# Altium project bms_mainboard-1_1.PrjPcb (part 3 of 8)

## Sheet pmic_tps65263_buck.SchDoc
size B
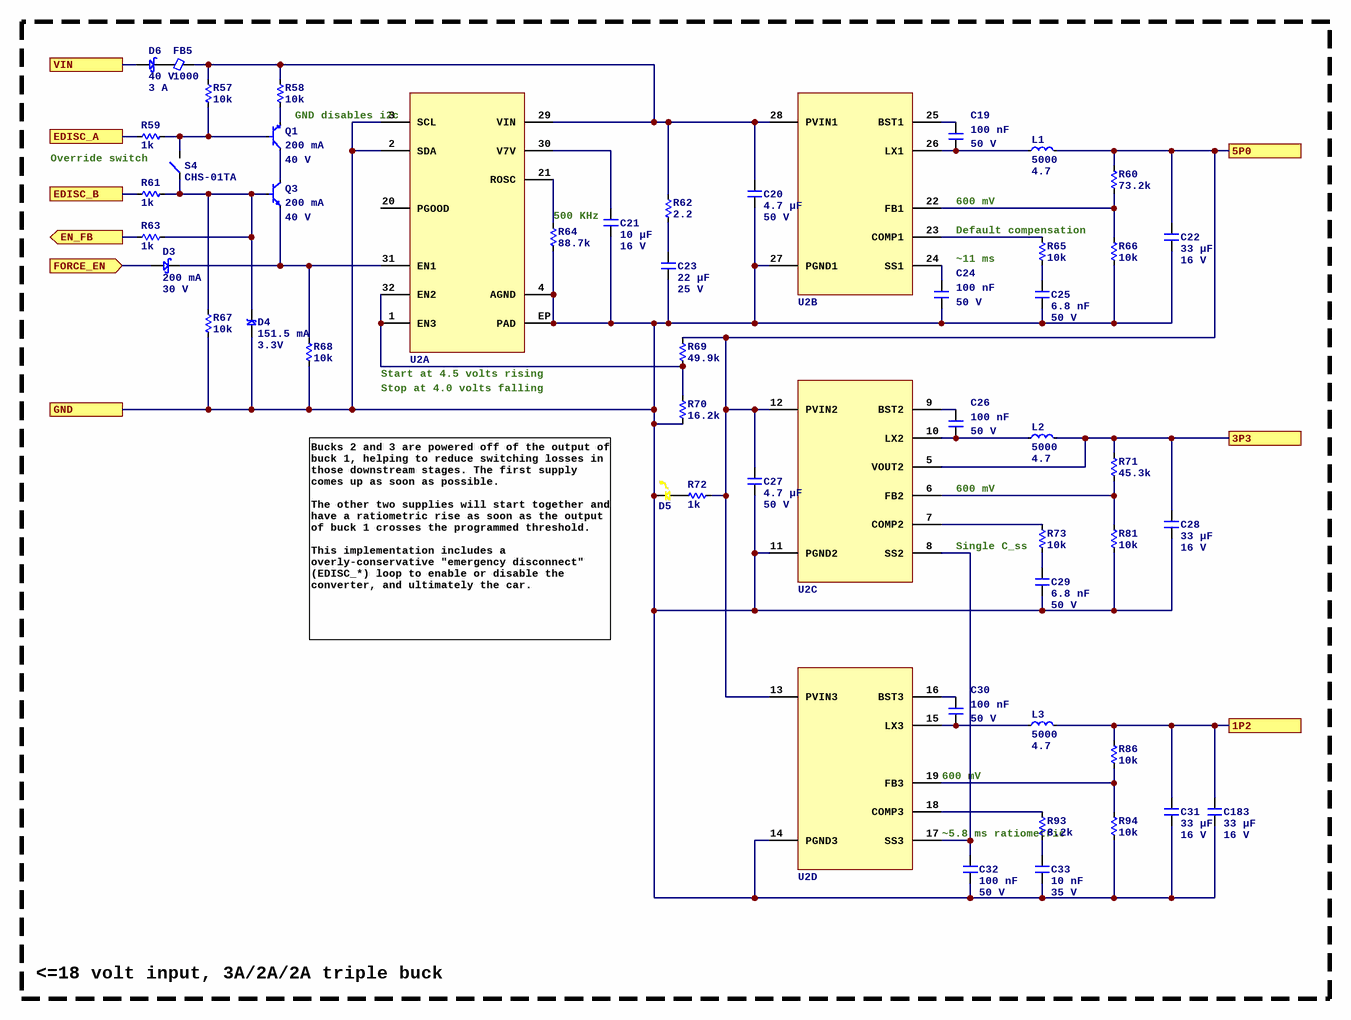
[diagram p13: pmic_tps65263_buck.SchDoc]

### Parts
C19  Capacitance: 100 nF  Voltage Rating: 50 V  [C0402]  (hidden comment: CL05B104KB54PNC)
C20  Capacitance: 4.7 µF  Voltage Rating: 50 V  [C0805]  (hidden comment: 0805B475K500NT)
C21  Capacitance: 10 µF  Voltage Rating: 16 V  [C0805]  (hidden comment: CL21B106KOQNNNE)
C22  Capacitance: 33 µF  Voltage Rating: 16 V  [C1812]  (hidden comment: C4532X7R1C336MT000N)
C23  Capacitance: 22 µF  Voltage Rating: 25 V  [C2220]  (hidden comment: C5750X7R1E226MT000N)
C24  Capacitance: 100 nF  Voltage Rating: 50 V  [C0402]  (hidden comment: CL05B104KB54PNC)
C25  Capacitance: 6.8 nF  Voltage Rating: 50 V  [C0402]  (hidden comment: GRM1555C1H682GE01D)
C26  Capacitance: 100 nF  Voltage Rating: 50 V  [C0402]  (hidden comment: CL05B104KB54PNC)
C27  Capacitance: 4.7 µF  Voltage Rating: 50 V  [C0805]  (hidden comment: 0805B475K500NT)
C28  Capacitance: 33 µF  Voltage Rating: 16 V  [C1812]  (hidden comment: C4532X7R1C336MT000N)
C29  Capacitance: 6.8 nF  Voltage Rating: 50 V  [C0402]  (hidden comment: GRM1555C1H682GE01D)
C30  Capacitance: 100 nF  Voltage Rating: 50 V  [C0402]  (hidden comment: CL05B104KB54PNC)
C31  Capacitance: 33 µF  Voltage Rating: 16 V  [C1812]  (hidden comment: C4532X7R1C336MT000N)
C32  Capacitance: 100 nF  Voltage Rating: 50 V  [C0402]  (hidden comment: CL05B104KB54PNC)
C33  Capacitance: 10 nF  Voltage Rating: 35 V  [C0402]  (hidden comment: GRM1555CYA103GE01D)
C183  Capacitance: 33 µF  Voltage Rating: 16 V  [C1812]  (hidden comment: C4532X7R1C336MT000N)
D3  Current: 200 mA  Vr: 30 V  [SOD523]  (hidden comment: BAT54XV2T1G)
D4  Current: 151.5 mA  Vr: 3.3V  [SOD523]  (hidden comment: SZMM5Z3V3T1G)
D5  LTST-C190YKT  [LED_0603P_YELLOW]  (value not drawn)
D6  Vr: 40 V  Current: 3 A  [SMA]  (hidden comment: B340A-13-F)
FB5  Current Rating (mA): 1000  [FB0805]  (hidden comment: HCB2012KF-102T10)
L1  Current Rating (mA): 5000  Inductance (µH): 4.7  [SMD-4.1x4.1x2.0]  (hidden comment: FTC404020S4R7MGCA)
L2  Current Rating (mA): 5000  Inductance (µH): 4.7  [SMD-4.1x4.1x2.0]  (hidden comment: FTC404020S4R7MGCA)
L3  Current Rating (mA): 5000  Inductance (µH): 4.7  [SMD-4.1x4.1x2.0]  (hidden comment: FTC404020S4R7MGCA)
Q1  Current: 200 mA  Voltage: 40 V  [3SOT523]  (hidden comment: MMBT3906T)
Q3  Current: 200 mA  Voltage: 40 V  [3SOT523]  (hidden comment: MMBT3904T)
R57  value 10k  [R0402]  (hidden comment: 0402WGF1002TCE)
R58  value 10k  [R0402]  (hidden comment: 0402WGF1002TCE)
R59  value 1k  [R0402]  (hidden comment: 0402WGF1001TCE)
R60  value 73.2k  [R0402]  (hidden comment: 0402WGF7322TCE)
R61  value 1k  [R0402]  (hidden comment: 0402WGF1001TCE)
R62  value 2.2  [R0805]  (hidden comment: HP05W3F220KT5E)
R63  value 1k  [R0402]  (hidden comment: 0402WGF1001TCE)
R64  value 88.7k  [R0402]  (hidden comment: 0402WGF8872TCE)
R65  value 10k  [R0402]  (hidden comment: 0402WGF1002TCE)
R66  value 10k  [R0402]  (hidden comment: 0402WGF1002TCE)
R67  value 10k  [R0402]  (hidden comment: 0402WGF1002TCE)
R68  value 10k  [R0402]  (hidden comment: 0402WGF1002TCE)
R69  value 49.9k  [R0402]  (hidden comment: 0402WGD4992TCE)
R70  value 16.2k  [R0402]  (hidden comment: 0402WGF1622TCE)
R71  value 45.3k  [R0402]  (hidden comment: FRC0402F4532TS)
R72  value 1k  [R0402]  (hidden comment: 0402WGF1001TCE)
R73  value 10k  [R0402]  (hidden comment: 0402WGF1002TCE)
R81  value 10k  [R0402]  (hidden comment: 0402WGF1002TCE)
R86  value 10k  [R0402]  (hidden comment: 0402WGF1002TCE)
R93  value 8.2k  [R0402]  (hidden comment: 0402WGF8201TCE)
R94  value 10k  [R0402]  (hidden comment: 0402WGF1002TCE)
S4  CHS-01TA  [SWITCH_NIDEC_CHS-01TA]
U2  TPS65263QRHBRQ1  [TI_RHB]  (value not drawn)  (parts A,B,C,D of 4)

### Ports
1P2, 3P3, 5P0, EDISC_A, EDISC_B, EN_FB (out), FORCE_EN (in), GND, VIN

### Nets
1P2: C31.1 C183.1 L3.2 R86.2 ; port 1P2
3P3: C28.1 L2.2 R71.2 U2.5(VOUT2) ; port 3P3
5P0: C22.1 C27.1 L1.2 R60.2 R69.2 R72.2 U2.12(PVIN2) U2.13(PVIN3) ; port 5P0
GND: C20.2 C21.2 C22.2 C23.2 C24.2 C25.2 C27.2 C28.2 C29.2 C31.2 C32.2 C33.2 C183.2 D4.1 D5.2 R64.1 R66.1 R67.1 R68.1 R70.1 R81.1 R94.1 U2.2(SDA) U2.3(SCL) U2.4(AGND) U2.11(PGND2) U2.14(PGND3) U2.27(PGND1) U2.EP(PAD) ; port GND
SYS: D6.1 ; port VIN
EDISC_A: R59.1 ; port EDISC_A
EDISC_B: R61.1 ; port EDISC_B
PMIC_EN_DETECT: R63.1 ; port EN_FB
PMIC_FORCE_EN: D3.1 ; port FORCE_EN
NetC19_1: C19.1 U2.25(BST1)
NetC19_2: C19.2 L1.1 U2.26(LX1)
NetC20_1: C20.1 FB5.2 R57.2 R58.2 R62.2 U2.28(PVIN1) U2.29(VIN)
NetC21_1: C21.1 U2.30(V7V)
NetC23_1: C23.1 R62.1
NetC24_1: C24.1 U2.24(SS1)
NetC25_1: C25.1 R65.1
NetC26_1: C26.1 U2.9(BST2)
NetC26_2: C26.2 L2.1 U2.10(LX2)
NetC29_1: C29.1 R73.1
NetC30_1: C30.1 U2.16(BST3)
NetC30_2: C30.2 L3.1 U2.15(LX3)
NetC32_1: C32.1 U2.8(SS2) U2.17(SS3)
NetC33_1: C33.1 R93.1
NetD3_2: D3.2 Q3.2(E) R68.2 U2.31(EN1)
NetD4_2: D4.2 Q3.1(B) R61.2 R63.2 R67.2 S4.1
NetD5_1: D5.1 R72.1
NetD6_2: D6.2 FB5.1
NetQ1_1: Q1.1(B) R57.1 R59.2 S4.2
NetQ1_2: Q1.2(E) R58.1
NetQ1_3: Q1.3(C) Q3.3(C)
NetR60_1: R60.1 R66.2 U2.22(FB1)
NetR64_2: R64.2 U2.21(ROSC)
NetR65_2: R65.2 U2.23(COMP1)
NetR69_1: R69.1 R70.2 U2.1(EN3) U2.32(EN2)
NetR71_1: R71.1 R81.2 U2.6(FB2)
NetR73_2: R73.2 U2.7(COMP2)
NetR86_1: R86.1 R94.2 U2.19(FB3)
NetR93_2: R93.2 U2.18(COMP3)

Not connected (* = marked no-connect by the designer): U2 20(PGOOD)

### Notes on the sheet
- Override switch
- GND disables i2c
- (near R64) 500 KHz
- 600 mV
- (near R65) Default compensation
- ~11 ms
- Start at 4.5 volts rising
- Stop at 4.0 volts falling
- Single C_ss
- Bucks 2 and 3 are powered off of the output of buck 1, helping to reduce switching losses in those downstream stages. The first supply comes up as soon as possible.
  The other two supplies will start together and have a ratiometric rise as soon as the output of buck 1 crosses the programmed threshold.
  This implementation includes a overly-conservative "emergency disconnect" (EDISC_*) loop to enable or disable the converter, and ultimately the car.
- (near U2) 600 mV
- (near R93) ~5.8 ms ratiometric
- <=18 volt input, 3A/2A/2A triple buck

### Library data of the parts
C19 C24 C26 C30 C32 = CL05B104KB54PNC: Manufacturer: Samsung Electro-Mechanics; Dielectric: X7R; ComponentLink1URL: https://wmsc.lcsc.com/wmsc/upload/file/pdf/v2/lcsc/2304140030_Samsung-Electro-Mechanics-CL05B104KB54PNC_C307331.pdf; ComponentLink1Description: Datasheet; Manufacturer Part Number: CL05B104KB54PNC; Package: 0402; Supplier 2: LCSC; Supplier Part Number 2: C307331
C20 C27 = 0805B475K500NT: Manufacturer: FH (Guangdong Fenghua Advanced Tech); Dielectric: X7R; ComponentLink1URL: https://wmsc.lcsc.com/wmsc/upload/file/pdf/v2/lcsc/2204111630_FH--Guangdong-Fenghua-Advanced-Tech-0805B475K500NT_C2991173.pdf; ComponentLink1Description: Datasheet; Manufacturer Part Number: 0805B475K500NT; Package: 0805; Supplier 2: LCSC; Supplier Part Number 2: C2991173
C21 = CL21B106KOQNNNE: Manufacturer: Samsung Electro-Mechanics; Dielectric: X7R; ComponentLink1URL: https://wmsc.lcsc.com/wmsc/upload/file/pdf/v2/lcsc/2304140030_Samsung-Electro-Mechanics-CL21B106KOQNNNE_C95841.pdf; ComponentLink1Description: Datasheet; Manufacturer Part Number: CL21B106KOQNNNE; Package: 0805; Supplier 2: LCSC; Supplier Part Number 2: C95841
C22 C28 C31 C183 = C4532X7R1C336MT000N: Manufacturer: TDK; Dielectric: X7R; ComponentLink1URL: https://wmsc.lcsc.com/wmsc/upload/file/pdf/v2/lcsc/2304140030_TDK-C4532X7R1C336MT000N_C342604.pdf; ComponentLink1Description: Datasheet; Manufacturer Part Number: C4532X7R1C336MT000N; Package: 1812; Supplier 2: LCSC; Supplier Part Number 2: C342604
C23 = C5750X7R1E226MT000N: Manufacturer: TDK; Dielectric: X7R; ComponentLink1URL: https://wmsc.lcsc.com/wmsc/upload/file/pdf/v2/lcsc/2409291207_TDK-C5750X7R1E226MT000N_C76694.pdf; ComponentLink1Description: Datasheet; Manufacturer Part Number: C5750X7R1E226MT000N; Package: 2220; Supplier 2: LCSC; Supplier Part Number 2: C76694
C25 C29 = GRM1555C1H682GE01D: Manufacturer: Murata Electronics; Dielectric: C0G; ComponentLink1URL: https://wmsc.lcsc.com/wmsc/upload/file/pdf/v2/lcsc/2308111508_Murata-Electronics-GRM1555C1H682GE01D_C3856821.pdf; ComponentLink1Description: Datasheet; Manufacturer Part Number: GRM1555C1H682GE01D; Package: 0402; Supplier 2: LCSC; Supplier Part Number 2: C3856821
C33 = GRM1555CYA103GE01D: Manufacturer: Murata Electronics; Dielectric: C0G; ComponentLink1URL: https://wmsc.lcsc.com/wmsc/upload/file/pdf/v2/lcsc/2308111509_Murata-Electronics-GRM1555CYA103GE01D_C3834692.pdf; ComponentLink1Description: Datasheet; Manufacturer Part Number: GRM1555CYA103GE01D; Package: 0402; Supplier 2: LCSC; Supplier Part Number 2: C3834692
D3 = BAT54XV2T1G: ON Semi BAT54XV2T1G; SMT Schottky Diode; 30V 200mA; 5ns; 2-Pin SOD-523; Manufacturer: onsemi; Supplier 1: DigiKey; Supplier Part Number 1: BAT54XV2T1GOSCT-ND; Manufacturer Part Number: BAT54XV2T1G; Supplier 2: LCSC; Supplier Part Number 2: C81572; Diode Type: Schottky; Supplier 3: Mouser; Supplier Part Number 3: 863-BAT54XV2T1G; ComponentLink1Description: Datasheet; ComponentLink1URL: https://www.onsemi.com/pdf/datasheet/bat54xv2t1-d.pdf
D4 = SZMM5Z3V3T1G: 500 mW Standard Tolerance Zener Diode Voltage Regulators 3.3 V (Automotive); Manufacturer: onsemi; Supplier 1: DigiKey; Supplier Part Number 1: SZMM5Z3V3T1GOSCT-ND; Manufacturer Part Number: SZMM5Z3V3T1G; ComponentLink1Description: Datasheet; ComponentLink1URL: https://www.onsemi.com/pdf/datasheet/mm5z2v4t1-d.pdf; Supplier 2: LCSC; Supplier Part Number 2: C464127; Diode Type: Zener; Supplier 3: Mouser; Supplier Part Number 3: 863-SZMM5Z3V3T1G
D5 = LTST-C190YKT: LED YELLOW CLEAR 0603 SMD; Manufacturer: Lite-On Inc; Vf: 2.1 V; If: 20 mA; Supplier 1: DigiKey; ComponentLink1URL: https://mm.digikey.com/Volume0/opasdata/d220001/medias/docus/1176/LTST-C190YKT.pdf; ComponentLink1Description: Datasheet; Supplier Part Number 1: 160-1184-1-ND; Manufacturer Part Number: LTST-C190YKT; Supplier 2: LCSC; Supplier Part Number 2: C125097; LED Color: Yellow; Supplier 3: Mouser; Supplier Part Number 3: 859-LTST-C190YKT
D6 = B340A-13-F: Rectifier Diode, Schottky, 1 Phase, 1 Element, 3A, 40V V(RRM), Silicon; Manufacturer: Diodes; Supplier 1: DigiKey; ComponentLink1URL: https://www.diodes.com/assets/Datasheets/ds30891.pdf; Supplier Part Number 1: B340A-FDICT-ND; ComponentLink1Description: Datasheet; Manufacturer Part Number: B340A-13-F; Supplier 2: LCSC; Supplier Part Number 2: C85098; Diode Type: Schottky; Supplier 3: Mouser; Supplier Part Number 3: 621-B340A-F
FB5 = HCB2012KF-102T10: Manufacturer: TAI-TECH; DCR (mOhms): 200; ComponentLink1URL: https://wmsc.lcsc.com/wmsc/upload/file/pdf/v2/lcsc/2009171138_TAI-TECH-HCB2012KF-102T10_C356985.pdf; ComponentLink1Description: Datasheet; Manufacturer Part Number: HCB2012KF-102T10; Package: 0805; Z @ 100 MHz: 1000; Supplier 2: LCSC; Supplier Part Number 2: C356985
L1-L3 = FTC404020S4R7MGCA: 4.7 µH SMD power inductor; Manufacturer: cjiang; DCR (mOhms): 58; ComponentLink1URL: https://www.lcsc.com/datasheet/C39676072.pdf; ComponentLink1Description: Datasheet; Manufacturer Part Number: FTC404020S4R7MGCA; Supplier 2: LCSC; Supplier Part Number 2: C39676072
Q1 = MMBT3906T: Bipolar (BJT) Transistor NPN 40 V 200 mA 300MHz 150 mW Surface Mount SOT-523; Manufacturer: Shenzhen Slkormicro Semicon Co., Ltd.; Polarity: PNP; Supplier 1: DigiKey; Supplier Part Number 1: 5399-MMBT3906TCT-ND; Manufacturer Part Number: MMBT3906T; Supplier 2: LCSC; Supplier Part Number 2: C61615; ComponentLink1Description: Datasheet; ComponentLink1URL: https://mm.digikey.com/Volume0/opasdata/d220001/medias/docus/7136/5399_MMBT3906T%20SOT-523.pdf
Q3 = MMBT3904T: Bipolar (BJT) Transistor NPN 40 V 200 mA 300MHz 150 mW Surface Mount SOT-523; Manufacturer: Shenzhen Slkormicro Semicon Co., Ltd.; Supplier 1: DigiKey; Supplier Part Number 1: 5399-MMBT3904TCT-ND; Manufacturer Part Number: MMBT3904T; ComponentLink1Description: Datasheet; ComponentLink1URL: https://mm.digikey.com/Volume0/opasdata/d220001/medias/docus/7136/5399_MMBT3904T%20SOT-523.pdf; Supplier 2: LCSC; Supplier Part Number 2: C61616; Polarity: NPN
R57 R58 R65-R68 R73 R81 R86 R94 = 0402WGF1002TCE: Manufacturer: UNI-ROYAL(Uniroyal Elec); Tolerance: 1%; Temperature Coefficient: ±100ppm/?; Power Rating (mW): 62.5; ComponentLink1Description: Datasheet; ComponentLink1URL: https://wmsc.lcsc.com/wmsc/upload/file/pdf/v2/lcsc/2206010100_UNI-ROYAL-Uniroyal-Elec-0402WGF1002TCE_C25744.pdf; Manufacturer Part Number: 0402WGF1002TCE; Package: 0402; Supplier 2: LCSC; Supplier Part Number 2: C25744
R59 R61 R63 R72 = 0402WGF1001TCE: Manufacturer: UNI-ROYAL(Uniroyal Elec); Tolerance: 1%; Temperature Coefficient: ±100ppm/?; Power Rating (mW): 62.5; ComponentLink1Description: Datasheet; ComponentLink1URL: https://wmsc.lcsc.com/wmsc/upload/file/pdf/v2/lcsc/2206010216_UNI-ROYAL-Uniroyal-Elec-0402WGF1001TCE_C11702.pdf; Manufacturer Part Number: 0402WGF1001TCE; Package: 0402; Supplier 2: LCSC; Supplier Part Number 2: C11702
R60 = 0402WGF7322TCE: Manufacturer: UNI-ROYAL(Uniroyal Elec); Tolerance: 1%; Temperature Coefficient: ±100ppm/?; Power Rating (mW): 62.5; ComponentLink1Description: Datasheet; ComponentLink1URL: https://wmsc.lcsc.com/wmsc/upload/file/pdf/v2/lcsc/2206010030_UNI-ROYAL-Uniroyal-Elec-0402WGF7322TCE_C26986.pdf; Manufacturer Part Number: 0402WGF7322TCE; Package: 0402; Supplier 2: LCSC; Supplier Part Number 2: C26986
R62 = HP05W3F220KT5E: Manufacturer: UNI-ROYAL(Uniroyal Elec); Tolerance: 1%; Temperature Coefficient: ±100ppm/?; Power Rating (mW): 333.3; ComponentLink1Description: Datasheet; ComponentLink1URL: https://datasheet.lcsc.com/lcsc/2304140030_UNI-ROYAL-Uniroyal-Elec-HP05W3F220KT5E_C2759317.pdf; Manufacturer Part Number: HP05W3F220KT5E; Package: 0805; Supplier 2: LCSC; Supplier Part Number 2: C2759317
R64 = 0402WGF8872TCE: Manufacturer: UNI-ROYAL(Uniroyal Elec); Tolerance: 1%; Temperature Coefficient: ±100ppm/?; Power Rating (mW): 62.5; ComponentLink1Description: Datasheet; ComponentLink1URL: https://wmsc.lcsc.com/wmsc/upload/file/pdf/v2/lcsc/2206010045_UNI-ROYAL-Uniroyal-Elec-0402WGF8872TCE_C25922.pdf; Manufacturer Part Number: 0402WGF8872TCE; Package: 0402; Supplier 2: LCSC; Supplier Part Number 2: C25922
R69 = 0402WGD4992TCE: Manufacturer: UNI-ROYAL(Uniroyal Elec); Tolerance: 0.5%; Temperature Coefficient: ±100ppm/?; Power Rating (mW): 62.5; ComponentLink1Description: Datasheet; ComponentLink1URL: https://wmsc.lcsc.com/wmsc/upload/file/pdf/v2/lcsc/2411221126_UNI-ROYAL-Uniroyal-Elec-0402WGD4992TCE_C407729.pdf; Manufacturer Part Number: 0402WGD4992TCE; Package: 0402; Supplier 2: LCSC; Supplier Part Number 2: C407729
R70 = 0402WGF1622TCE: Manufacturer: UNI-ROYAL(Uniroyal Elec); Tolerance: 1%; Temperature Coefficient: ±100ppm/?; Power Rating (mW): 62.5; ComponentLink1Description: Datasheet; ComponentLink1URL: https://wmsc.lcsc.com/wmsc/upload/file/pdf/v2/lcsc/2206010030_UNI-ROYAL-Uniroyal-Elec-0402WGF1622TCE_C27176.pdf; Manufacturer Part Number: 0402WGF1622TCE; Package: 0402; Supplier 2: LCSC; Supplier Part Number 2: C27176
R71 = FRC0402F4532TS: Manufacturer: FOJAN; Tolerance: 1%; Temperature Coefficient: ±100ppm/?; Power Rating (mW): 62.5; ComponentLink1Description: Datasheet; ComponentLink1URL: https://datasheet.lcsc.com/lcsc/2308241947_FOJAN-FRC0402F4532TS_C2933099.pdf; Manufacturer Part Number: FRC0402F4532TS; Package: 0402; Supplier 2: LCSC; Supplier Part Number 2: C2933099
R93 = 0402WGF8201TCE: Manufacturer: UNI-ROYAL(Uniroyal Elec); Tolerance: 1%; Temperature Coefficient: ±100ppm/?; Power Rating (mW): 62.5; ComponentLink1Description: Datasheet; ComponentLink1URL: https://wmsc.lcsc.com/wmsc/upload/file/pdf/v2/lcsc/2206010045_UNI-ROYAL-Uniroyal-Elec-0402WGF8201TCE_C25924.pdf; Manufacturer Part Number: 0402WGF8201TCE; Package: 0402; Supplier 2: LCSC; Supplier Part Number 2: C25924
S4 = CHS-01TA: DIP Switch, Slide, SPST, Flush, Recessed, 6VDC, 100mA, CHS Series Ž Nidec Components CHS-01TA; Manufacturer: Nidec Copal; Supplier 1: DigiKey; Supplier Part Number 1: 563-1003-1-ND; Manufacturer Part Number: CHS-01TA; ComponentLink1Description: Datasheet; ComponentLink1URL: https://www.nidec-components.com/e/catalog/switch/chs.pdf; Supplier 2: LCSC; Supplier Part Number 2: C2921603; Supplier 3: Mouser; Supplier Part Number 3: 229-CHS-01TA
U2 = TPS65263QRHBRQ1: Switching Regulator, Current-mode, 3A, 2300kHz Switching Freq-Max, PQCC32; Manufacturer: Texas Instruments; Supplier 1: DigiKey; Supplier Part Number 1: 296-40886-1-ND; Supplier 2: LCSC; Supplier Part Number 2: C2073290; Manufacturer Part Number: TPS65263QRHBRQ1; Supplier 3: Mouser; Supplier Part Number 3: 595-TPS65263QRHBRQ1; ComponentLink1Description: Datasheet; ComponentLink1URL: https://www.ti.com/lit/ds/symlink/tps65263-q1.pdf

## Sheet conn_sdcard.SchDoc
size A
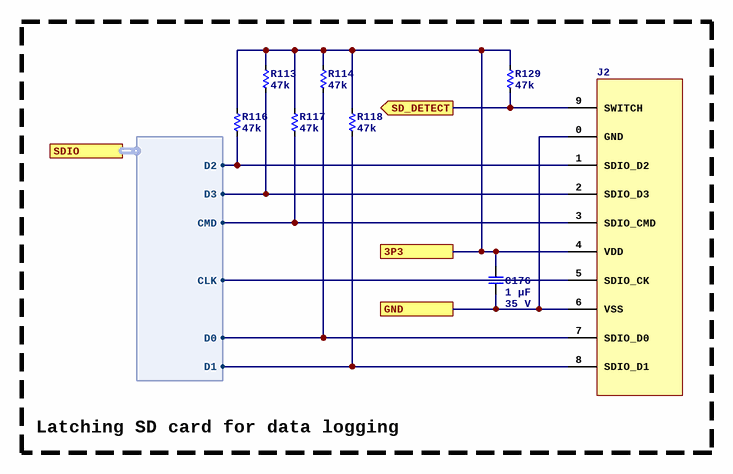
[diagram p14: conn_sdcard.SchDoc]

### Parts
C176  Capacitance: 1 µF  Voltage Rating: 35 V  [C0603]  (hidden comment: GMK107AB7105KAHT)
J2  DM3BT-DSF-PEJS  [HIROSE_DM3BT]  (value not drawn)
R113  value 47k  [R0402]  (hidden comment: 0402WGF4702TCE)
R114  value 47k  [R0402]  (hidden comment: 0402WGF4702TCE)
R116  value 47k  [R0402]  (hidden comment: 0402WGF4702TCE)
R117  value 47k  [R0402]  (hidden comment: 0402WGF4702TCE)
R118  value 47k  [R0402]  (hidden comment: 0402WGF4702TCE)
R129  value 47k  [R0402]  (hidden comment: 0402WGF4702TCE)

### Blocks framed on the sheet
Latching SD card for data logging: C176 J2 R113 R114 R116-R118 R129

### Ports
3P3, GND, SD_DETECT (out), SDIO (harness SDIO)

### Harnesses
SDIO: CLK, D0, D1, CMD, D2, D3

### Nets
3P3: C176.1 J2.4(VDD) R113.2 R114.2 R116.2 R117.2 R118.2 R129.2 ; port 3P3
GND: C176.2 J2.0(GND) J2.6(VSS) ; port GND
SD_DETECT: J2.9(SWITCH) R129.1 ; port SD_DETECT
SDIO.CLK: J2.5(SDIO_CK) ; port SDIO.CLK
SDIO.CMD: J2.3(SDIO_CMD) R117.1 ; port SDIO.CMD
SDIO.D0: J2.7(SDIO_D0) R114.1 ; port SDIO.D0
SDIO.D1: J2.8(SDIO_D1) R118.1 ; port SDIO.D1
SDIO.D2: J2.1(SDIO_D2) R116.1 ; port SDIO.D2
SDIO.D3: J2.2(SDIO_D3) R113.1 ; port SDIO.D3

### Library data of the parts
C176 = GMK107AB7105KAHT: Manufacturer: Taiyo Yuden; Dielectric: X7R; ComponentLink1URL: https://datasheet.lcsc.com/lcsc/2304140030_Taiyo-Yuden-GMK107AB7105KAHT_C841050.pdf; ComponentLink1Description: Datasheet; Manufacturer Part Number: GMK107AB7105KAHT; Package: 0603; Supplier 2: LCSC; Supplier Part Number 2: C841050
J2 = DM3BT-DSF-PEJS: CONN MICRO SD R/A PUSH-PUSH SMD; Manufacturer: Hirose Electric Co Ltd; Supplier 1: DigiKey; ComponentLink1URL: http://www.hirose.co.jp/cataloge_hp/e60900232.pdf; ComponentLink1Description: Datasheet; Supplier Part Number 1: HR1942CT-ND; Manufacturer Part Number: DM3BT-DSF-PEJS; Supplier 2: LCSC; Supplier Part Number 2: C597972; Supplier 3: Mouser; Supplier Part Number 3: 798-DM3BT-DSF-PEJS
R113 R114 R116-R118 R129 = 0402WGF4702TCE: Manufacturer: UNI-ROYAL(Uniroyal Elec); Tolerance: 1%; Temperature Coefficient: ±100ppm/?; Power Rating (mW): 62.5; ComponentLink1Description: Datasheet; ComponentLink1URL: https://wmsc.lcsc.com/wmsc/upload/file/pdf/v2/lcsc/2206010100_UNI-ROYAL-Uniroyal-Elec-0402WGF4702TCE_C25792.pdf; Manufacturer Part Number: 0402WGF4702TCE; Package: 0402; Supplier 2: LCSC; Supplier Part Number 2: C25792

## Sheet adc_mcp3914.SchDoc
size A
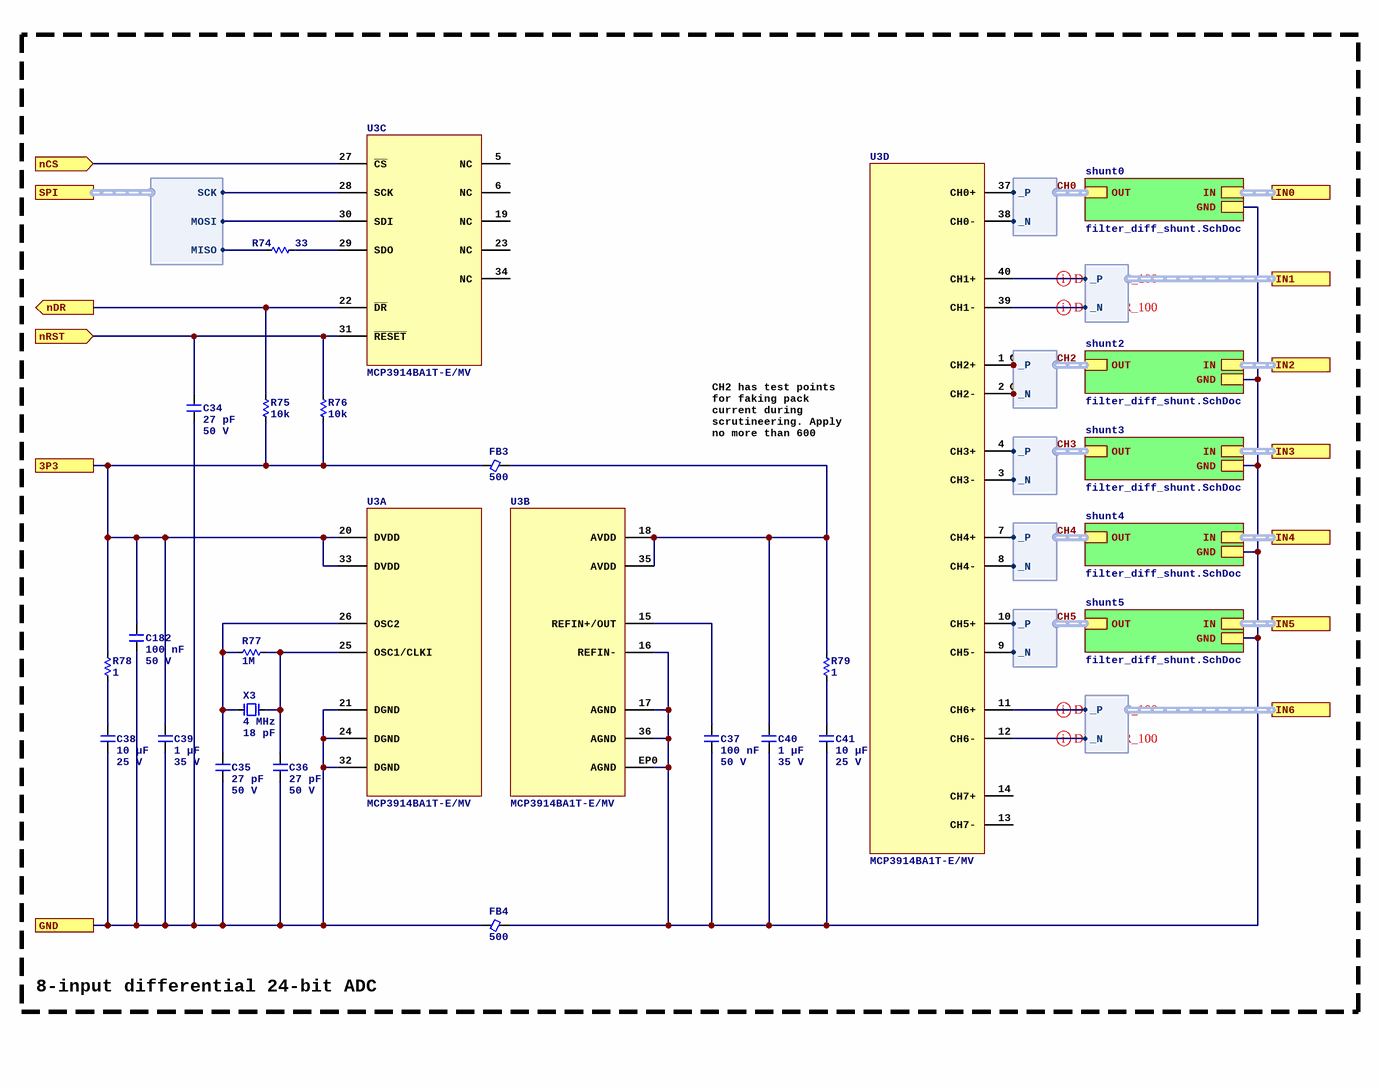
[diagram p15: adc_mcp3914.SchDoc]

### Parts
C34  Capacitance: 27 pF  Voltage Rating: 50 V  [C0402]  (hidden comment: 0402CG270J500NT)
C35  Capacitance: 27 pF  Voltage Rating: 50 V  [C0402]  (hidden comment: 0402CG270J500NT)
C36  Capacitance: 27 pF  Voltage Rating: 50 V  [C0402]  (hidden comment: 0402CG270J500NT)
C37  Capacitance: 100 nF  Voltage Rating: 50 V  [C0402]  (hidden comment: CL05B104KB54PNC)
C38  Capacitance: 10 µF  Voltage Rating: 25 V  [C0805]  (hidden comment: CL21B106KAYQNNE)
C39  Capacitance: 1 µF  Voltage Rating: 35 V  [C0603]  (hidden comment: GMK107AB7105KAHT)
C40  Capacitance: 1 µF  Voltage Rating: 35 V  [C0603]  (hidden comment: GMK107AB7105KAHT)
C41  Capacitance: 10 µF  Voltage Rating: 25 V  [C0805]  (hidden comment: CL21B106KAYQNNE)
C182  Capacitance: 100 nF  Voltage Rating: 50 V  [C0402]  (hidden comment: CL05B104KB54PNC)
FB3  Current Rating (mA): 500  [FB0402]  (hidden comment: BLM15AX601SN1D)
FB4  Current Rating (mA): 500  [FB0402]  (hidden comment: BLM15AX601SN1D)
R74  value 33  [R0402]  (hidden comment: 0402WGF330JTCE)
R75  value 10k  [R0402]  (hidden comment: 0402WGF1002TCE)
R76  value 10k  [R0402]  (hidden comment: 0402WGF1002TCE)
R77  value 1M  [R0402]  (hidden comment: 0402WGF1004TCE)
R78  value 1  [R0402]  (hidden comment: CRCW04021R00FKED)
R79  value 1  [R0402]  (hidden comment: CRCW04021R00FKED)
TP71  RH-5000  [TP_RH-5000]  (value not drawn)
TP72  RH-5001  [TP_RH-5001]  (value not drawn)
U3  MCP3914BA1T-E/MV  [MICROCHIP_MV]  (parts A,B,C,D of 4)
X3  Frequency: 4 MHz  Capacitance: 18 pF  [XTAL_HC49US_SMD]  (hidden comment: ABLS2-4.000MHZ-D4Y-T)

### Sub-sheets
shunt0 = filter_diff_shunt.SchDoc: IN (harness DIFF), OUT (harness DIFF), GND
shunt2 = filter_diff_shunt.SchDoc: IN (harness DIFF), OUT (harness DIFF), GND
shunt3 = filter_diff_shunt.SchDoc: IN (harness DIFF), OUT (harness DIFF), GND
shunt4 = filter_diff_shunt.SchDoc: IN (harness DIFF), OUT (harness DIFF), GND
shunt5 = filter_diff_shunt.SchDoc: IN (harness DIFF), OUT (harness DIFF), GND

### Ports
3P3, GND, IN0 (harness DIFF), IN1 (harness DIFF), IN2 (harness DIFF), IN3 (harness DIFF), IN4 (harness DIFF), IN5 (harness DIFF), IN6 (harness DIFF), nCS (in), nDR (out), nRST (in), SPI (harness SPI)

### Harnesses
DIFF: _N, _P
SPI: MISO, MOSI, SCK

### Nets
3P3_B: C39.1 C182.1 FB3.1 R75.2 R76.2 R78.2 U3.20(DVDD) U3.33(DVDD) ; port 3P3
HV_N: C34.2 C35.2 C36.2 C38.2 C39.2 C182.2 FB4.1 U3.21(DGND) U3.24(DGND) U3.32(DGND) ; port GND
CH0._N: U3.38(CH0-) ; sheet shunt0/OUT._N
CH0._P: U3.37(CH0+) ; sheet shunt0/OUT._P
CH2._N: TP72.1 U3.2(CH2-) ; sheet shunt2/OUT._N
CH2._P: TP71.1 U3.1(CH2+) ; sheet shunt2/OUT._P
CH3._N: U3.3(CH3-) ; sheet shunt3/OUT._N
CH3._P: U3.4(CH3+) ; sheet shunt3/OUT._P
CH4._N: U3.8(CH4-) ; sheet shunt4/OUT._N
CH4._P: U3.7(CH4+) ; sheet shunt4/OUT._P
CH5._N: U3.9(CH5-) ; sheet shunt5/OUT._N
CH5._P: U3.10(CH5+) ; sheet shunt5/OUT._P
HV_VS._N: U3.39(CH1-) ; port IN1._N
HV_VS._P: U3.40(CH1+) ; port IN1._P
IMD_VS._N: U3.12(CH6-) ; port IN6._N
IMD_VS._P: U3.11(CH6+) ; port IN6._P
MCP3914B_nDR_ISO: R75.1 U3.22(~{DR}) ; port nDR
MCP3914B_nRST_ISO: C34.1 R76.1 U3.31(~{RESET}) ; port nRST
SPI4_ISO.MISO: R74.2 ; port SPI.MISO
SPI4_ISO.MOSI: U3.30(SDI) ; port SPI.MOSI
SPI4_ISO.SCK: U3.28(SCK) ; port SPI.SCK
SPI4_nSS_ISO: U3.27(~{CS}) ; port nCS
NetC35_1: C35.1 R77.2 U3.26(OSC2) X3.2
NetC36_1: C36.1 R77.1 U3.25(OSC1/CLKI) X3.1
NetC37_1: C37.1 U3.15(REFIN+/OUT)
NetC37_2: C37.2 C40.2 C41.2 FB4.2 U3.16(REFIN-) U3.17(AGND) U3.36(AGND) U3.EP0(AGND) ; sheet shunt0/GND, sheet shunt2/GND, sheet shunt3/GND, sheet shunt4/GND, sheet shunt5/GND
NetC38_1: C38.1 R78.1
NetC40_1: C40.1 FB3.2 R79.2 U3.18(AVDD) U3.35(AVDD)
NetC41_1: C41.1 R79.1
NetR74_1: R74.1 U3.29(SDO)

Not connected (* = marked no-connect by the designer): U3 5(NC) 6(NC) 13(CH7-) 14(CH7+) 19(NC) 23(NC) 34(NC)

### Buses and harness runs
harness CH0 = sheet shunt0/OUT
harness CH2 = sheet shunt2/OUT
harness CH3 = sheet shunt3/OUT
harness CH4 = sheet shunt4/OUT
harness CH5 = sheet shunt5/OUT
harness port IN0 = sheet shunt0/IN
harness port IN2 = sheet shunt2/IN
harness port IN3 = sheet shunt3/IN
harness port IN4 = sheet shunt4/IN
harness port IN5 = sheet shunt5/IN

### Layout directives
differential pair; differential pair class DE_100: HV_VS._N, HV_VS._P, IMD_VS._N, IMD_VS._P

### Notes on the sheet
- CH2 has test points for faking pack current during scrutineering. Apply no more than 600 millivolts of either polarity.
- 8-input differential 24-bit ADC

### Library data of the parts
C34-C36 = 0402CG270J500NT: Manufacturer: FH(Guangdong Fenghua Advanced Tech); Dielectric: C0G; ComponentLink1URL: https://wmsc.lcsc.com/wmsc/upload/file/pdf/v2/lcsc/2304140030_FH--Guangdong-Fenghua-Advanced-Tech-0402CG270J500NT_C1557.pdf; ComponentLink1Description: Datasheet; Manufacturer Part Number: 0402CG270J500NT; Package: 0402; Supplier 2: LCSC; Supplier Part Number 2: C1557
C37 C182 = CL05B104KB54PNC: as C19 on sheet pmic_tps65263_buck; ComponentLink1URL: https://wmsc.lcsc.com/wmsc/upload/file/pdf/v2/lcsc/2304140030_Samsung-Electro-Mechanics-CL05B104KB54PNC_C307331.pdf; ComponentLink1Description: Datasheet; Manufacturer Part Number: CL05B104KB54PNC; Package: 0402; Supplier 2: LCSC; Supplier Part Number 2: C307331
C38 C41 = CL21B106KAYQNNE: Manufacturer: Samsung Electro-Mechanics; Dielectric: X7R; ComponentLink1URL: https://datasheet.lcsc.com/lcsc/2206222030_Samsung-Electro-Mechanics-CL21B106KAYQNNE_C3039694.pdf; ComponentLink1Description: Datasheet; Manufacturer Part Number: CL21B106KAYQNNE; Package: 0805; Supplier 2: LCSC; Supplier Part Number 2: C3039694
C39 C40 = GMK107AB7105KAHT: as C176 on sheet conn_sdcard; ComponentLink1URL: https://datasheet.lcsc.com/lcsc/2304140030_Taiyo-Yuden-GMK107AB7105KAHT_C841050.pdf; ComponentLink1Description: Datasheet; Manufacturer Part Number: GMK107AB7105KAHT; Package: 0603; Supplier 2: LCSC; Supplier Part Number 2: C841050
FB3 FB4 = BLM15AX601SN1D: Manufacturer: Murata Electronics; Z @ 100 MHz: 600; DCR (mOhms): 340; ComponentLink1URL: https://wmsc.lcsc.com/wmsc/upload/file/pdf/v2/lcsc/2304140030_Murata-Electronics-BLM15AX601SN1D_C76886.pdf; ComponentLink1Description: Datasheet; Manufacturer Part Number: BLM15AX601SN1D; Supplier 2: LCSC; Supplier Part Number 2: C76886; Package: 0402
R74 = 0402WGF330JTCE: Manufacturer: UNI-ROYAL(Uniroyal Elec); Tolerance: 1%; Temperature Coefficient: ±100ppm/?; Power Rating (mW): 62.5; ComponentLink1Description: Datasheet; ComponentLink1URL: https://wmsc.lcsc.com/wmsc/upload/file/pdf/v2/lcsc/2205311900_UNI-ROYAL-Uniroyal-Elec-0402WGF330JTCE_C25105.pdf; Manufacturer Part Number: 0402WGF330JTCE; Package: 0402; Supplier 2: LCSC; Supplier Part Number 2: C25105
R75 R76 = 0402WGF1002TCE: as R57 on sheet pmic_tps65263_buck; ComponentLink1Description: Datasheet; ComponentLink1URL: https://wmsc.lcsc.com/wmsc/upload/file/pdf/v2/lcsc/2206010100_UNI-ROYAL-Uniroyal-Elec-0402WGF1002TCE_C25744.pdf; Manufacturer Part Number: 0402WGF1002TCE; Package: 0402; Supplier 2: LCSC; Supplier Part Number 2: C25744
R77 = 0402WGF1004TCE: Manufacturer: UNI-ROYAL(Uniroyal Elec); Tolerance: 1%; Temperature Coefficient: ±100ppm/?; Power Rating (mW): 62.5; ComponentLink1Description: Datasheet; ComponentLink1URL: https://wmsc.lcsc.com/wmsc/upload/file/pdf/v2/lcsc/2206010030_UNI-ROYAL-Uniroyal-Elec-0402WGF1004TCE_C26083.pdf; Manufacturer Part Number: 0402WGF1004TCE; Package: 0402; Supplier 2: LCSC; Supplier Part Number 2: C26083
R78 R79 = CRCW04021R00FKED: Manufacturer: Vishay Intertech; Tolerance: 1%; Temperature Coefficient: ±100ppm/?; Power Rating (mW): 63; ComponentLink1Description: Datasheet; ComponentLink1URL: https://wmsc.lcsc.com/wmsc/upload/file/pdf/v2/lcsc/2211030200_Vishay-Intertech-CRCW04021R00FKED_C482087.pdf; Manufacturer Part Number: CRCW04021R00FKED; Package: 0402; Supplier 2: LCSC; Supplier Part Number 2: C482087
TP71 = RH-5000: Red through-hole PCB test point; Manufacturer: ronghe; ComponentLink1Description: Datasheet; ComponentLink1URL: https://datasheet.lcsc.com/lcsc/2307040929_ronghe-RH-5000_C5277086.pdf; Manufacturer Part Number: RH-5000; Supplier 2: LCSC; Supplier Part Number 2: C5277086
TP72 = RH-5001: Black through-hole PCB test point; Manufacturer: ronghe; ComponentLink1Description: Datasheet; ComponentLink1URL: https://datasheet.lcsc.com/lcsc/2307040929_ronghe-RH-5000_C5277086.pdf; Manufacturer Part Number: RH-5001; Supplier 2: LCSC; Supplier Part Number 2: C5199801
U3 = MCP3914BA1T-E/MV: 8 Channel AFE 24 Bit 40-UQFN (5x5); Manufacturer: Microchip; Manufacturer Part Number: MCP3914BA1T-E/MV; Supplier 1: DigiKey; Supplier Part Number 1: 150-MCP3914BA1T-E/MVCT-ND; Supplier 3: Mouser; Supplier Part Number 3: 579-MCP3914BA1T-E/MV; ComponentLink1Description: Datasheet; ComponentLink1URL: https://ww1.microchip.com/downloads/aemDocuments/documents/MSLD/ProductDocuments/MCP3914B-Data-Sheet-DS20007010.pdf
X3 = ABLS2-4.000MHZ-D4Y-T: CRYSTAL 4.000 MHZ 18PF SMD; Manufacturer: Abracon LLC; Supplier 1: DigiKey; Manufacturer Part Number: ABLS2-4.000MHZ-D4Y-T; ComponentLink1URL: http://www.abracon.com/Resonators/ABLS2.pdf; ComponentLink1Description: Datasheet; Supplier Part Number 1: 535-9857-1-ND; Supplier 2: LCSC; Supplier Part Number 2: C5933228; Supplier 3: Mouser; Supplier Part Number 3: 815-ABLS2-4-D4Y-T

## Sheet filter_diff_shunt.SchDoc
size A
Used 5 times, as channels adc_mcp3914/shunt0, adc_mcp3914/shunt2, adc_mcp3914/shunt3, adc_mcp3914/shunt4, adc_mcp3914/shunt5. Parts and nets are listed once, with the designators drawn on the sheet.
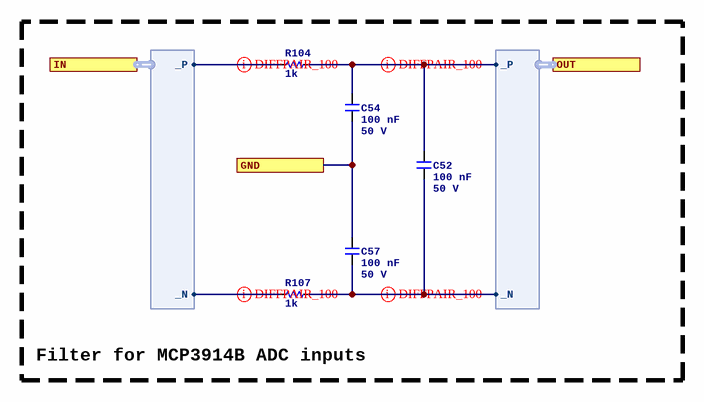
[diagram p16: filter_diff_shunt.SchDoc]

### Parts
C52  Capacitance: 100 nF  Voltage Rating: 50 V  [C0402]  (hidden comment: CL05B104KB54PNC)
C54  Capacitance: 100 nF  Voltage Rating: 50 V  [C0402]  (hidden comment: CL05B104KB54PNC)
C57  Capacitance: 100 nF  Voltage Rating: 50 V  [C0402]  (hidden comment: CL05B104KB54PNC)
R104  value 1k  [R0402]  (hidden comment: 0402WGF1001TCE)
R107  value 1k  [R0402]  (hidden comment: 0402WGF1001TCE)

### Blocks framed on the sheet
Filter for MCP3914B ADC inputs: C52 C54 C57 R104 R107

### Ports
GND, IN (harness DIFF), OUT (harness DIFF)

### Harnesses
DIFF: _N, _P

### Nets
GND: C54.2 C57.1 ; port GND
NetC52_1: C52.1 C54.1 R104.1 ; port OUT._P
NetC52_2: C52.2 C57.2 R107.1 ; port OUT._N
NetR104_2: R104.2 ; port IN._P
NetR107_2: R107.2 ; port IN._N

### Channels
adc_mcp3914/shunt0: designators end in A; ports GND=NetC37_2
adc_mcp3914/shunt2: designators end in B; ports GND=NetC37_2
adc_mcp3914/shunt3: designators end in C; ports GND=NetC37_2
adc_mcp3914/shunt4: designators end in D; ports GND=NetC37_2
adc_mcp3914/shunt5: designators end in E; ports GND=NetC37_2

### Layout directives
differential pair; differential pair class DE_100: CH0._N, CH0._P, DCDC_IS._N, DCDC_IS._P

### Library data of the parts
C52 C54 C57 = CL05B104KB54PNC: as C19 on sheet pmic_tps65263_buck; ComponentLink1URL: https://wmsc.lcsc.com/wmsc/upload/file/pdf/v2/lcsc/2304140030_Samsung-Electro-Mechanics-CL05B104KB54PNC_C307331.pdf; ComponentLink1Description: Datasheet; Manufacturer Part Number: CL05B104KB54PNC; Package: 0402; Supplier 2: LCSC; Supplier Part Number 2: C307331
R104 R107 = 0402WGF1001TCE: as R59 on sheet pmic_tps65263_buck; ComponentLink1Description: Datasheet; ComponentLink1URL: https://wmsc.lcsc.com/wmsc/upload/file/pdf/v2/lcsc/2206010216_UNI-ROYAL-Uniroyal-Elec-0402WGF1001TCE_C11702.pdf; Manufacturer Part Number: 0402WGF1001TCE; Package: 0402; Supplier 2: LCSC; Supplier Part Number 2: C11702

## Sheet hv_architecture.SchDoc
size B; SheetNumber: 3
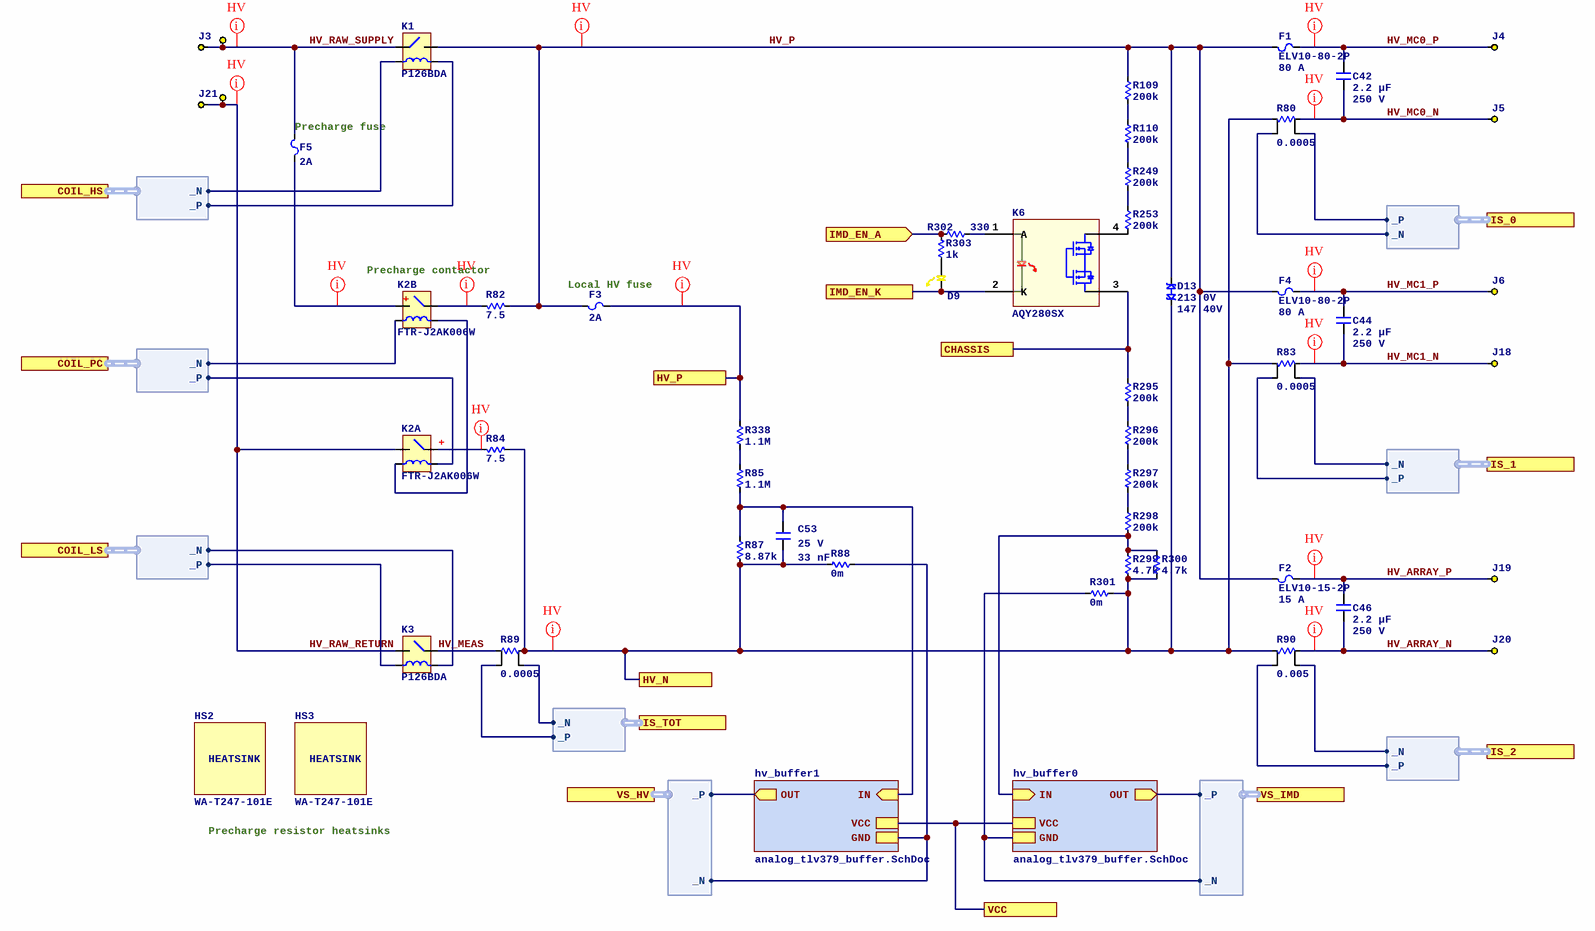
[diagram p17: hv_architecture.SchDoc]

### Parts
C42  Capacitance: 2.2 µF  Voltage Rating: 250 V  [C2220]  (hidden comment: C5750X7T2E225KT000N)
C44  Capacitance: 2.2 µF  Voltage Rating: 250 V  [C2220]  (hidden comment: C5750X7T2E225KT000N)
C46  Capacitance: 2.2 µF  Voltage Rating: 250 V  [C2220]  (hidden comment: C5750X7T2E225KT000N)
C53  Voltage Rating: 25 V  Capacitance: 33 nF  [C0402]  (hidden comment: 0402B333K250NT)
D9  LTST-C190YKT  [LED_0603P_YELLOW]  (value not drawn)
D13  Clamping Voltage-Max: 213.0V  Min Breakdown Voltage: 147.40V  [P600_VERTICAL]  (hidden comment: 30KPA132CA)
F1  ELV10-80-2P  Current: 80 A  [EATON_ELV10-xx-2P]
F2  ELV10-15-2P  Current: 15 A  [EATON_ELV10-xx-2P]
F3  Current: 2A  [BELFUSE_0ZRE0200FF]  (hidden comment: 0ZRE0200FF1A)
F4  ELV10-80-2P  Current: 80 A  [EATON_ELV10-xx-2P]
F5  Current: 2A  [BELFUSE_0ZRE0200FF]  (hidden comment: 0ZRE0200FF1A)
HS2  WA-T247-101E  [OHMITE_WA-T247-101E]
HS3  WA-T247-101E  [OHMITE_WA-T247-101E]
J3  7461086  [WURTH_TERM_7461086]  (value not drawn)
J4  7461086  [WURTH_TERM_7461086]  (value not drawn)
J5  7461086  [WURTH_TERM_7461086]  (value not drawn)
J6  7461086  [WURTH_TERM_7461086]  (value not drawn)
J18  7461086  [WURTH_TERM_7461086]  (value not drawn)
J19  7461086  [WURTH_TERM_7461086]  (value not drawn)
J20  7461086  [WURTH_TERM_7461086]  (value not drawn)
J21  7461086  [WURTH_TERM_7461086]  (value not drawn)
K1  P126BDA  [RELAY_P126]
K2  FTR-J2AK006W  [RELAY_FTR-J2]  (parts A,B of 2)
K3  P126BDA  [RELAY_P126]
K6  AQY280SX  [PANASONIC_AQY28]
R80  value 0.0005  [VISHAY_WSL2726]  (hidden comment: WSL2726L5000FEB)
R82  value 7.5  [TO-247-2_VERTICAL]  (hidden comment: TEH100M7R50FE)
R83  value 0.0005  [VISHAY_WSL2726]  (hidden comment: WSL2726L5000FEB)
R84  value 7.5  [TO-247-2_VERTICAL]  (hidden comment: TEH100M7R50FE)
R85  value 1.1M  [R0805]  (hidden comment: RT0805BRD071M1L)
R87  value 8.87k  [R0402]  (hidden comment: TC0210B8871TCC)
R88  value 0m  [R0402]  (hidden comment: 0402WGF0000TCE)
R89  value 0.0005  [VISHAY_WSL2726]  (hidden comment: WSL2726L5000FEB)
R90  value 0.005  [VISHAY_WSL2726]  (hidden comment: WSL27265L000FEB)
R109  value 200k  [R0603]  (hidden comment: 0603WAF2003T5E)
R110  value 200k  [R0603]  (hidden comment: 0603WAF2003T5E)
R249  value 200k  [R0603]  (hidden comment: 0603WAF2003T5E)
R253  value 200k  [R0603]  (hidden comment: 0603WAF2003T5E)
R295  value 200k  [R0603]  (hidden comment: 0603WAF2003T5E)
R296  value 200k  [R0603]  (hidden comment: 0603WAF2003T5E)
R297  value 200k  [R0603]  (hidden comment: 0603WAF2003T5E)
R298  value 200k  [R0603]  (hidden comment: 0603WAF2003T5E)
R299  value 4.7k  [R0402]  (hidden comment: 0402WGF4701TCE)
R300  value 4.7k  [R0402]  (hidden comment: 0402WGF4701TCE)
R301  value 0m  [R0402]  (hidden comment: 0402WGF0000TCE)
R302  value 330  [R0402]  (hidden comment: 0402WGF3300TCE)
R303  value 1k  [R0402]  (hidden comment: 0402WGF1001TCE)
R338  value 1.1M  [R0805]  (hidden comment: RT0805BRD071M1L)
TP3  RH-5000  [TP_RH-5000]  (value not drawn)
TP79  RH-5001  [TP_RH-5001]  (value not drawn)

### Sub-sheets
hv_buffer0 = analog_tlv379_buffer.SchDoc: IN (in), VCC, GND, OUT (out)
hv_buffer1 = analog_tlv379_buffer.SchDoc: IN (in), VCC, GND, OUT (out)

### Ports
CHASSIS, COIL_HS (harness DIFF), COIL_LS (harness DIFF), COIL_PC (harness DIFF), HV_N, HV_P, IMD_EN_A (in), IMD_EN_K, IS_0 (harness DIFF), IS_1 (harness DIFF), IS_2 (harness DIFF), IS_TOT (harness DIFF), VCC, VS_HV (harness DIFF), VS_IMD (harness DIFF)

### Harnesses
DIFF: _N, _P
DIFF: _P, _N

### Nets
3P3_B: port VCC, sheet hv_buffer0/VCC, sheet hv_buffer1/VCC
CHASSIS: K6.3 R295.2 ; port CHASSIS
GND: D9.2 K6.2(K) ; port IMD_EN_K
HV_N: C53.2 D13.1 R80.2 R83.2 R84.2 R87.2 R88.2 R89.2 R90.2 R299.1 R300.1 R301.2 ; port HV_N
HV_P: F3.2 R338.1 ; port HV_P
ARRAY_IS._N: R90.3 ; port IS_2._N
ARRAY_IS._P: R90.4 ; port IS_2._P
BATT_IS._N: R89.4 ; port IS_TOT._N
BATT_IS._P: R89.3 ; port IS_TOT._P
COIL_HS._N: K1.1 ; port COIL_HS._N
COIL_HS._P: K1.2 ; port COIL_HS._P
COIL_LS._N: K3.1 ; port COIL_LS._N
COIL_LS._P: K3.2 ; port COIL_LS._P
COIL_PC._N: K2.4 ; port COIL_PC._N
COIL_PC._P: K2.1 ; port COIL_PC._P
HV_ARRAY_N: C46.2 J20.0 R90.1  [project net HV_ARRAY_N_3]
HV_ARRAY_P: C46.1 F2.2 J19.0  [project net HV_ARRAY_P_3]
HV_MC0_N: C42.2 J5.0 R80.1  [project net HV_MC0_N_3]
HV_MC0_P: C42.1 F1.2 J4.0  [project net HV_MC0_P_3]
HV_MC1_N: C44.2 J18.0 R83.1  [project net HV_MC1_N_3]
HV_MC1_P: C44.1 F4.2 J6.0  [project net HV_MC1_P_3]
HV_MEAS: K3.4 R89.1  [project net HV_MEAS_3]
HV_P: D13.2 F1.1 F2.1 F3.1 F4.1 K1.3 R82.2 R109.2  [project net HV_P_3]  [a separate net that carries the same name]
HV_RAW_RETURN: J21.0 K2.6 K3.3 TP79.1  [project net HV_RAW_RETURN_3]
HV_RAW_SUPPLY: F5.1 J3.0 K1.4 TP3.1  [project net HV_RAW_SUPPLY_3]
HV_VS._N: R88.1 ; sheet hv_buffer1/GND, port VS_HV._N
HV_VS._P: sheet hv_buffer1/OUT, port VS_HV._P
IMD_HIGH_SIDE_SWITCH_EN: R302.2 R303.1 ; port IMD_EN_A
IMD_VS._N: R301.1 ; sheet hv_buffer0/GND, port VS_IMD._N
IMD_VS._P: sheet hv_buffer0/OUT, port VS_IMD._P
MC0_IS._N: R80.4 ; port IS_0._N
MC0_IS._P: R80.3 ; port IS_0._P
MC1_IS._N: R83.3 ; port IS_1._N
MC1_IS._P: R83.4 ; port IS_1._P
NetC53_1: C53.1 R85.2 R87.1 ; sheet hv_buffer1/IN
NetD9_1: D9.1 R303.2
NetF5_2: F5.2 K2.8
NetK2_2: K2.2 K2.3
NetK2_5: K2.5 R84.1
NetK2_7: K2.7 R82.1
NetK6_1: K6.1(A) R302.1
NetK6_4: K6.4 R253.1
NetR85_1: R85.1 R338.2
NetR109_1: R109.1 R110.2
NetR110_1: R110.1 R249.2
NetR249_1: R249.1 R253.2
NetR295_1: R295.1 R296.2
NetR296_1: R296.1 R297.2
NetR297_1: R297.1 R298.2
NetR298_1: R298.1 R299.2 R300.2 ; sheet hv_buffer0/IN

### Layout directives
net class HV: HV_ARRAY_N_3, HV_ARRAY_P_3, HV_MC0_N_3, HV_MC0_P_3, HV_MC1_N_3, HV_MC1_P_3, HV_N, HV_P, HV_P_3, HV_RAW_RETURN_3, HV_RAW_SUPPLY_3, NetF5_2, NetK2_5, NetK2_7

### Notes on the sheet
- (near F5) Precharge fuse
- Precharge contactor
- (near F3) Local HV fuse
- Precharge resistor heatsinks
- (in symbol FTR-J2AK006W, part A) +
- (in symbol FTR-J2AK006W, part B) +
- (in symbol WA-T247-101E) HEATSINK

### Library data of the parts
C42 C44 C46 = C5750X7T2E225KT000N: Manufacturer: TDK; Dielectric: X7T; ComponentLink1URL: https://wmsc.lcsc.com/wmsc/upload/file/pdf/v2/lcsc/2304140030_TDK-C5750X7T2E225KT000N_C435266.pdf; ComponentLink1Description: Datasheet; Manufacturer Part Number: C5750X7T2E225KT000N; Package: 2220; Supplier 2: LCSC; Supplier Part Number 2: C435266
C53 = 0402B333K250NT: Manufacturer: FH (Guangdong Fenghua Advanced Tech); Dielectric: X7R; Manufacturer Part Number: 0402B333K250NT; Package: 0402; Supplier 2: LCSC; Supplier Part Number 2: C285174; ComponentLink1Description: Datasheet; ComponentLink1URL: https://datasheet.lcsc.com/lcsc/2110191430_FH--Guangdong-Fenghua-Advanced-Tech-0402B333K250NT_C285174.pdf
D9 = LTST-C190YKT: as D5 on sheet pmic_tps65263_buck; Supplier 1: DigiKey; ComponentLink1URL: https://mm.digikey.com/Volume0/opasdata/d220001/medias/docus/1176/LTST-C190YKT.pdf; ComponentLink1Description: Datasheet; Supplier Part Number 1: 160-1184-1-ND; Manufacturer Part Number: LTST-C190YKT; Supplier 2: LCSC; Supplier Part Number 2: C125097; LED Color: Yellow; Supplier 3: Mouser; Supplier Part Number 3: 859-LTST-C190YKT
D13 = 30KPA132CA: 213V Clamp 142.3A Ipp Tvs Diode Through Hole P600; Manufacturer: Littelfuse; Polarity: Bidirectional; Standoff (V): 132; Power (W): 30000; Supplier 1: DigiKey; Supplier Part Number 1: 30KPA132CACT-ND; Manufacturer Part Number: 30KPA132CA; ComponentLink1URL: https://www.littelfuse.com/assetdocs/littelfuse_tvs_diode_30kpa_datasheet.pdf; ComponentLink1Description: Datasheet; Supplier 2: LCSC; Supplier Part Number 2: C7175979
F1 F4 = ELV10-80-2P: FUSE EV 80A 200VDC 2P TERM; Manufacturer: Eaton; Fuse Type: Cartridge; VDC: 200 V; Supplier 1: DigiKey; Supplier Part Number 1: 283-ELV10-80-2P-ND; Manufacturer Part Number: ELV10-80-2P; ComponentLink1Description: Datasheet; ComponentLink1URL: https://www.eaton.com/content/dam/eaton/products/electronic-components/resources/data-sheet/eaton-elv10-10x25mm-ev-fuse-data-sheet-elx1302-en.pdf; Supplier 3: Mouser; Supplier Part Number 3: 504-ELV10-80-2P
F2 = ELV10-15-2P: 15A 200 VDC Fuse Cartridge Through Hole; Manufacturer: Eaton; VDC: 200 V; Supplier 1: DigiKey; Supplier Part Number 1: 283-ELV10-15-2P-ND; Manufacturer Part Number: ELV10-15-2P; ComponentLink1Description: Datasheet; ComponentLink1URL: https://www.eaton.com/content/dam/eaton/products/electronic-components/resources/data-sheet/eaton-elv10-10x25mm-ev-fuse-data-sheet-elx1302-en.pdf; Fuse Type: Cartridge; Supplier 3: Mouser; Supplier Part Number 3: 504-ELV10-15-2P
F3 F5 = 0ZRE0200FF1A: Polymeric PTC Resettable Fuse 240V 2 A Ih Through Hole Radial, Disc; Manufacturer: Bel Fuse Inc.; Fuse Type: Resettable PTC; Supplier 1: DigiKey; Supplier Part Number 1: 5923-0ZRE0200FF1A-ND; Manufacturer Part Number: 0ZRE0200FF1A; Supplier 2: LCSC; ComponentLink1Description: Datasheet; ComponentLink1URL: https://www.belfuse.com/media/datasheets/products/circuit-protection/ds-cp-0zre-series.pdf; VDC: 240 V; VAC: 240 V; Supplier Part Number 2: C3760983; Supplier 3: Mouser; Supplier Part Number 3: 530-0ZRE0200FF1A
HS2 HS3 = WA-T247-101E: Heat Sink, 11ohm, Extruded, Clip, Longitudinal, Aluminum Alloy, Anodized; Manufacturer: Ohmite; Supplier 1: DigiKey; Supplier Part Number 1: WA-T247-101E-ND; Manufacturer Part Number: WA-T247-101E; ComponentLink1Description: Datasheet; ComponentLink1URL: https://www.ohmite.com/assets/images/sink-w.pdf; Supplier 3: Mouser; Supplier Part Number 3: 588-WA-T247-101E
J3-J6 J18-J21 = 7461086: POWER ELEMENT BUSH M4 12PIN; Manufacturer: Wurth Electronics; Supplier 1: DigiKey; Supplier Part Number 1: 732-3207-ND; Manufacturer Part Number: 7461086; Supplier 2: LCSC; Supplier Part Number 2: C6089860; Supplier 3: Mouser; Supplier Part Number 3: 710-7461086; ComponentLink1Description: Datasheet; ComponentLink1URL: https://www.we-online.com/components/products/datasheet/7461086.pdf
K1 K3 = P126BDA: RELAY GEN PURPOSE SPST 60A 12V; Manufacturer: Sensata; Supplier 1: DigiKey; Supplier Part Number 1: 3596-P126BDA-ND; Manufacturer Part Number: P126BDA; ComponentLink1Description: Datasheet; ComponentLink1URL: https://www.sensata.com/sites/default/files/a/sensata-gigavac-p126-series-minitactor-contactors-datasheet.pdf; Supplier 3: Mouser; Supplier Part Number 3: 682-P126BDA
K2 = FTR-J2AK006W: General Purpose Relay 450VDC/10A; Manufacturer: Fujitsu; Manufacturer Part Number: FTR-J2AK006W; ComponentLink1URL: https://www.fcl-components.com/downloads/MICRO/fcai/relays/ftr-j2.pdf; ComponentLink1Description: Datasheet; Supplier 3: Mouser; Supplier Part Number 3: 817-FTR-J2AK006W
K6 = AQY280SX: Solid State Photo-Coupled Relay (Photorelay) SPST-NO (1 Form A) 4-SOP (0.173", 4.40mm); Manufacturer: Panasonic Industry; Supplier 1: DigiKey; Supplier Part Number 1: 255-3913-1-ND; Manufacturer Part Number: AQY280SX; ComponentLink1URL: https://mm.digikey.com/Volume0/opasdata/d220001/medias/docus/2807/AQY%2CW28xS_DS.pdf; ComponentLink1Description: Datasheet; Supplier 2: LCSC; Supplier Part Number 2: C425101; Supplier 3: Mouser; Supplier Part Number 3: 769-AQY280SX
R80 R83 R89 = WSL2726L5000FEB: Manufacturer: Vishay Dale; Tolerance: 1%; Power Rating (mW): 3000; Supplier 1: DigiKey; Manufacturer Part Number: WSL2726L5000FEB; ComponentLink1URL: http://www.vishay.com/docs/30131/wsl2726.pdf; ComponentLink1Description: Datasheet; Supplier Part Number 1: WSLQ-.0005CT-ND; Supplier 2: LCSC; Supplier Part Number 2: C4132421; Package: 2726
R82 R84 = TEH100M7R50FE: Manufacturer: Ohmite; Tolerance: 1%; Power Rating (mW): 100000; Supplier 1: DigiKey; Manufacturer Part Number: TEH100M7R50FE; ComponentLink1URL: http://www.ohmite.com/cat/res_teh100.pdf; ComponentLink1Description: Datasheet; Supplier Part Number 1: TEH100M7R50FE-ND; Supplier 2: LCSC; Supplier Part Number 2: C2641795; Package: TO-247
R85 R338 = RT0805BRD071M1L: Manufacturer: YAGEO; Tolerance: 0.1%; Temperature Coefficient: ±25ppm/?; Power Rating (mW): 125; ComponentLink1Description: Datasheet; ComponentLink1URL: https://wmsc.lcsc.com/wmsc/upload/file/pdf/v2/lcsc/2304140030_YAGEO-RT0805BRD071M1L_C136925.pdf; Manufacturer Part Number: RT0805BRD071M1L; Package: 0805; Supplier 2: LCSC; Supplier Part Number 2: C136925
R87 = TC0210B8871TCC: Manufacturer: UNI-ROYAL(Uniroyal Elec); Tolerance: 0.1%; Temperature Coefficient: ±10ppm/?; Power Rating (mW): 62.5; ComponentLink1Description: Datasheet; ComponentLink1URL: https://wmsc.lcsc.com/wmsc/upload/file/pdf/v2/lcsc/2409272202_UNI-ROYAL-Uniroyal-Elec-TC0210B8871TCC_C517790.pdf; Manufacturer Part Number: TC0210B8871TCC; Package: 0402; Supplier 2: LCSC; Supplier Part Number 2: C517790
R88 R301 = 0402WGF0000TCE: Manufacturer: UNI-ROYAL(Uniroyal Elec); Power Rating (mW): 62.5; ComponentLink1Description: Datasheet; ComponentLink1URL: https://wmsc.lcsc.com/wmsc/upload/file/pdf/v2/lcsc/2206010216_UNI-ROYAL-Uniroyal-Elec-0402WGF0000TCE_C17168.pdf; Manufacturer Part Number: 0402WGF0000TCE; Package: 0402; Supplier 2: LCSC; Supplier Part Number 2: C17168
R90 = WSL27265L000FEB: Manufacturer: Vishay Dale; Tolerance: 1%; Power Rating (mW): 3000; Supplier 1: DigiKey; Manufacturer Part Number: WSL27265L000FEB; ComponentLink1URL: http://www.vishay.com/docs/30131/wsl2726.pdf; ComponentLink1Description: Datasheet; Supplier Part Number 1: WSLQ-.005CT-ND; Supplier 2: LCSC; Supplier Part Number 2: C1517421; Package: 2726
R109 R110 R249 R253 R295-R298 = 0603WAF2003T5E: Manufacturer: UNI-ROYAL(Uniroyal Elec); Power Rating (mW): 100; Tolerance: 1%; Temperature Coefficient: ±100ppm/?; Manufacturer Part Number: 0603WAF2003T5E; Package: 0603; Supplier 2: LCSC; Supplier Part Number 2: C25811; ComponentLink1Description: Datasheet; ComponentLink1URL: https://wmsc.lcsc.com/wmsc/upload/file/pdf/v2/lcsc/2206010045_UNI-ROYAL-Uniroyal-Elec-0603WAF2003T5E_C25811.pdf
R299 R300 = 0402WGF4701TCE: Manufacturer: UNI-ROYAL(Uniroyal Elec); Power Rating (mW): 62.5; Tolerance: 1%; Temperature Coefficient: ±100ppm/?; Manufacturer Part Number: 0402WGF4701TCE; Package: 0402; Supplier 2: LCSC; Supplier Part Number 2: C25900; ComponentLink1Description: Datasheet; ComponentLink1URL: https://wmsc.lcsc.com/wmsc/upload/file/pdf/v2/lcsc/2206010045_UNI-ROYAL-Uniroyal-Elec-0402WGF4701TCE_C25900.pdf
R302 = 0402WGF3300TCE: Manufacturer: UNI-ROYAL(Uniroyal Elec); Tolerance: 1%; Temperature Coefficient: ±100ppm/?; Power Rating (mW): 62.5; ComponentLink1Description: Datasheet; ComponentLink1URL: https://wmsc.lcsc.com/wmsc/upload/file/pdf/v2/lcsc/2205311900_UNI-ROYAL-Uniroyal-Elec-0402WGF3300TCE_C25104.pdf; Manufacturer Part Number: 0402WGF3300TCE; Package: 0402; Supplier 2: LCSC; Supplier Part Number 2: C25104
R303 = 0402WGF1001TCE: as R59 on sheet pmic_tps65263_buck; ComponentLink1Description: Datasheet; ComponentLink1URL: https://wmsc.lcsc.com/wmsc/upload/file/pdf/v2/lcsc/2206010216_UNI-ROYAL-Uniroyal-Elec-0402WGF1001TCE_C11702.pdf; Manufacturer Part Number: 0402WGF1001TCE; Package: 0402; Supplier 2: LCSC; Supplier Part Number 2: C11702
TP3 = RH-5000: as TP71 on sheet adc_mcp3914; ComponentLink1Description: Datasheet; ComponentLink1URL: https://datasheet.lcsc.com/lcsc/2307040929_ronghe-RH-5000_C5277086.pdf; Manufacturer Part Number: RH-5000; Supplier 2: LCSC; Supplier Part Number 2: C5277086
TP79 = RH-5001: as TP72 on sheet adc_mcp3914; ComponentLink1Description: Datasheet; ComponentLink1URL: https://datasheet.lcsc.com/lcsc/2307040929_ronghe-RH-5000_C5277086.pdf; Manufacturer Part Number: RH-5001; Supplier 2: LCSC; Supplier Part Number 2: C5199801

## Sheet analog_tlv379_buffer.SchDoc
size A
Used 2 times, as channels hv/hv_buffer0, hv/hv_buffer1. Parts and nets are listed once, with the designators drawn on the sheet.
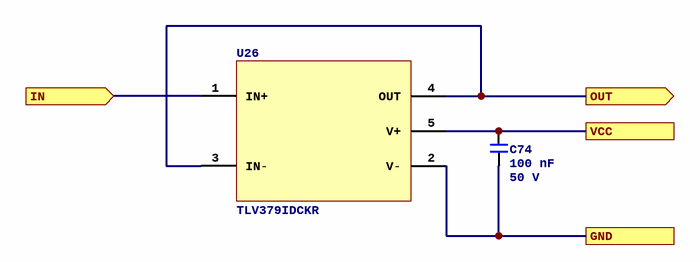
[diagram p18: analog_tlv379_buffer.SchDoc]

### Parts
C74  Capacitance: 100 nF  Voltage Rating: 50 V  [C0402]  (hidden comment: CL05B104KB54PNC)
U26  TLV379IDCKR  [5SC70]

### Ports
GND, IN (in), OUT (out), VCC

### Nets
GND: C74.2 U26.2(V-) ; port GND
IN: U26.1(IN+) ; port IN
OUT: U26.3(IN-) U26.4(OUT) ; port OUT
VCC: C74.1 U26.5(V+) ; port VCC

### Channels
hv/hv_buffer0: designators end in A; ports GND=IMD_VS._N IN=NetR298_1 OUT=IMD_VS._P VCC=3P3_B
hv/hv_buffer1: designators end in B; ports GND=HV_VS._N IN=NetC53_1 OUT=HV_VS._P VCC=3P3_B

### Library data of the parts
C74 = CL05B104KB54PNC: as C19 on sheet pmic_tps65263_buck; ComponentLink1URL: https://wmsc.lcsc.com/wmsc/upload/file/pdf/v2/lcsc/2304140030_Samsung-Electro-Mechanics-CL05B104KB54PNC_C307331.pdf; ComponentLink1Description: Datasheet; Manufacturer Part Number: CL05B104KB54PNC; Package: 0402; Supplier 2: LCSC; Supplier Part Number 2: C307331
U26 = TLV379IDCKR: Low-Voltage, 4-µA, Rail-to-Rail I/O Operational Amplifier for Cost-Sensitive Systems 5-SC70 -40 to 125; Manufacturer: Texas Instruments; Supplier 1: DigiKey; Supplier Part Number 1: 296-47844-1-ND; Manufacturer Part Number: TLV379IDCKR; Supplier Part Number 2: C2860386; ComponentLink1Description: Datasheet; ComponentLink1URL: https://www.ti.com/lit/ds/symlink/tlv379.pdf; Supplier 2: LCSC; Supplier 3: Mouser; Supplier Part Number 3: 595-TLV379IDCKR